# Altium project mRo_CANnode_V1_R1.PrjPcb
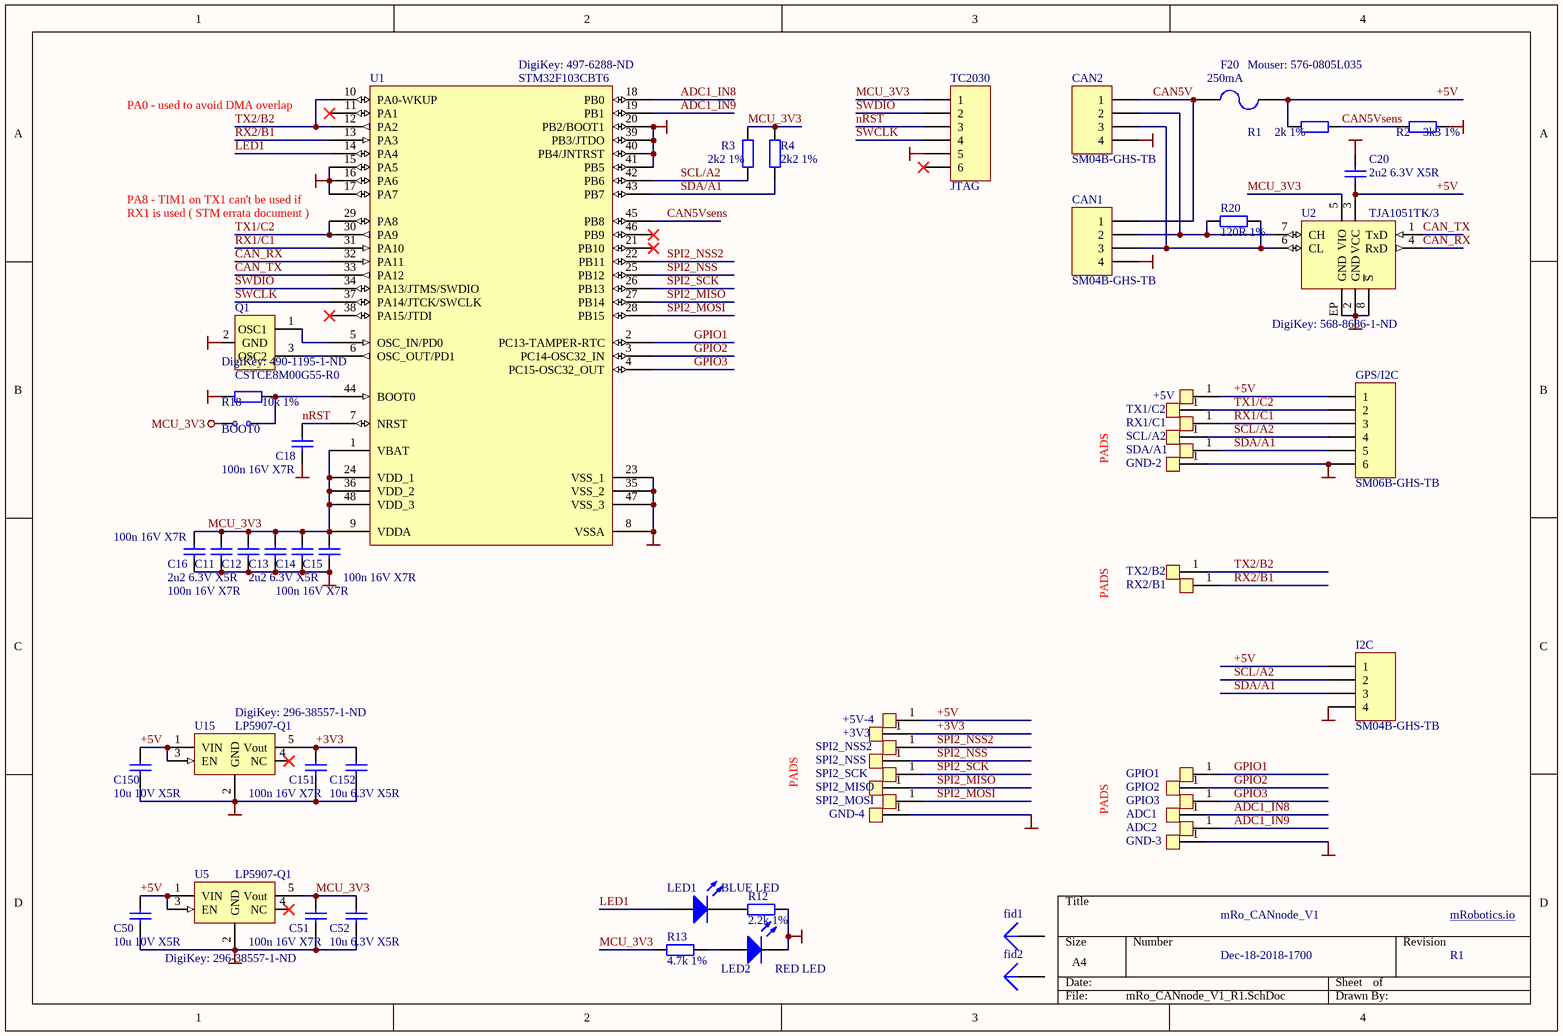
[diagram p0: mRo_CANnode_V1_R1.SchDoc]
1 sheet, 60 parts. Net scope: global (net labels, ports and power ports of the same name join across sheets).
Board file: mRo_CANnode_V1_R1.PcbDoc

## Sheet mRo_CANnode_V1_R1.SchDoc
size A4

### Parts
+3V3  +5V  [SMD_TEST_PAD]  (value not drawn)
+5V  +5V  [SMD_TEST_PAD]  (value not drawn)
+5V-4  +5V  [SMD_TEST_PAD]  (value not drawn)
ADC1  GND  [SMD_TEST_PAD]  (value not drawn)
ADC2  GND  [SMD_TEST_PAD]  (value not drawn)
BOOT0  BLOB  [BLOB 2]  (value not drawn)
C11  100n 16V X7R  [0402A]
C12  2u2 6.3V X5R  [0402A]
C13  2u2 6.3V X5R  [0402A]
C14  100n 16V X7R  [0402A]
C15  100n 16V X7R  [0402A]
C16  100n 16V X7R  [0402A]
C18  100n 16V X7R  [0402A]
C20  2u2 6.3V X5R  [0402A]
C50  10u 10V X5R  [0603A]
C51  100n 16V X7R  [0603A]
C52  10u 6.3V X5R  [0603A]
C150  10u 10V X5R  [0603A]
C151  100n 16V X7R  [0603A]
C152  10u 6.3V X5R  [0603A]
CAN1  SM04B-GHS-TB  [SM04B-GHS-TB]
CAN2  SM04B-GHS-TB  [SM04B-GHS-TB]
F20  250mA  Mouser: 576-0805L035  [0805A]
fid1  (no value)  [SMT_PAD]
fid2  (no value)  [SMT_PAD]
GND-2  GND  [SMD_TEST_PAD]  (value not drawn)
GND-3  GND  [SMD_TEST_PAD]  (value not drawn)
GND-4  GND  [SMD_TEST_PAD]  (value not drawn)
GPIO1  GPIO1  [SMD_TEST_PAD]  (value not drawn)
GPIO2  GPIO2  [SMD_TEST_PAD]  (value not drawn)
GPIO3  GPIO3  [SMD_TEST_PAD]  (value not drawn)
GPS/I2C  SM06B-GHS-TB  [SM06B-GHS-TB]
I2C  SM04B-GHS-TB  [SM04B-GHS-TB]
LED1  BLUE LED  [0603A]
LED2  RED LED  [0603A]
Q1  CSTCE8M00G55-R0  DigiKey: 490-1195-1-ND  [CERALOCK_RES]
R1  2k 1%  [0402A]
R2  3k3 1%  [0402A]
R3  2k2 1%  [0402A]
R4  2k2 1%  [0402A]
R12  2.2k 1%  [0402A]
R13  4.7k 1%  [0603A]
R18  10k 1%  [0402A]
R20  120R 1%  [0603A]
RX1/C1  RX1/TLM/C1  [SMD_TEST_PAD]  (value not drawn)
RX2/B1  RX2/B1  [SMD_TEST_PAD]  (value not drawn)
SCL/A2  SDA  [SMD_TEST_PAD]  (value not drawn)
SDA/A1  SDA/A1  [SMD_TEST_PAD]  (value not drawn)
SPI2_MISO  SPI2_MISO  [SMD_TEST_PAD]  (value not drawn)
SPI2_MOSI  SPI2_MOSI  [SMD_TEST_PAD]  (value not drawn)
SPI2_NSS  SPI2_NSS  [SMD_TEST_PAD]  (value not drawn)
SPI2_NSS2  SPI2_NSS2  [SMD_TEST_PAD]  (value not drawn)
SPI2_SCK  SPI2_SCK  [SMD_TEST_PAD]  (value not drawn)
TC2030  JTAG  [JTAG_TC2030]
TX1/C2  VDD_USB  [SMD_TEST_PAD]  (value not drawn)
TX2/B2  TX2/B2  [SMD_TEST_PAD]  (value not drawn)
U1  STM32F103CBT6  DigiKey: 497-6288-ND  [LQFP48_N]
U2  TJA1051TK/3  DigiKey: 568-8686-1-ND  [8DFN_3x3]
U5  LP5907-Q1  DigiKey: 296-38557-1-ND  [SOT23-5]
U15  LP5907-Q1  DigiKey: 296-38557-1-ND  [SOT23-5]

### Nets
GND: C11.1 C12.1 C13.1 C14.1 C15.1 C16.1 C18.1 C20.1 C50.1 C51.1 C52.1 C150.1 C151.1 C152.1 CAN1.4 CAN2.4 GND-2.1 GND-3.1 GND-4.1 GPS/I2C.6 I2C.4 LED2.2(K) Q1.2(GND) R2.1 R12.1 R18.2 TC2030.5 U1.8(VSSA) U1.15(PA5) U1.16(PA6) U1.17(PA7) U1.20(PB2/BOOT1) U1.23(VSS_1) U1.35(VSS_2) U1.39(PB3/JTDO) U1.40(PB4/JNTRST) U1.41(PB5) U1.47(VSS_3) U2.2(GND) U2.8(~{S}) U2.EP(GND) U5.2(GND) U15.2(GND)
MCU_3V3: BOOT0.1 C11.2 C12.2 C13.2 C14.2 C15.2 C16.2 C51.2 C52.2 R3.1 R4.1 R13.2 TC2030.1 U1.1(VBAT) U1.9(VDDA) U1.24(VDD_1) U1.36(VDD_2) U1.48(VDD_3) U2.5(VIO) U5.5(Vout)
+3V3: +3V3.1 C151.2 C152.2 U15.5(Vout)
+5V: +5V.1 +5V-4.1 C20.2 C50.2 C150.2 F20.2 GPS/I2C.1 I2C.1 R1.2 U2.3(VCC) U5.1(VIN) U5.3(EN) U15.1(VIN) U15.3(EN)
ADC1_IN8: ADC1.1 U1.18(PB0)
ADC1_IN9: ADC2.1 U1.19(PB1)
CAN5V: CAN1.1 CAN2.1 F20.1
CAN5Vsens: R1.1 R2.2 U1.45(PB8)
CAN_RX: U1.32(PA11) U2.4(RxD)
CAN_TX: U1.33(PA12) U2.1(TxD)
GPIO1: GPIO1.1 U1.2(PC13-TAMPER-RTC)
GPIO2: GPIO2.1 U1.3(PC14-OSC32_IN)
GPIO3: GPIO3.1 U1.4(PC15-OSC32_OUT)
LED1: LED1.1(A) U1.14(PA4)
nRST: C18.2 TC2030.3 U1.7(NRST)
RX1/C1: GPS/I2C.3 RX1/C1.1 U1.31(PA10)
RX2/B1: RX2/B1.1 U1.13(PA3)
SCL/A2: GPS/I2C.4 I2C.2 R3.2 SCL/A2.1 U1.42(PB6)
SDA/A1: GPS/I2C.5 I2C.3 R4.2 SDA/A1.1 U1.43(PB7)
SPI2_MISO: SPI2_MISO.1 U1.27(PB14)
SPI2_MOSI: SPI2_MOSI.1 U1.28(PB15)
SPI2_NSS: SPI2_NSS.1 U1.25(PB12)
SPI2_NSS2: SPI2_NSS2.1 U1.22(PB11)
SPI2_SCK: SPI2_SCK.1 U1.26(PB13)
SWCLK: TC2030.4 U1.37(PA14/JTCK/SWCLK)
SWDIO: TC2030.2 U1.34(PA13/JTMS/SWDIO)
TX1/C2: GPS/I2C.2 TX1/C2.1 U1.29(PA8) U1.30(PA9)
TX2/B2: TX2/B2.1 U1.10(PA0-WKUP) U1.12(PA2)
NetBOOT0_2: BOOT0.2 R18.1 U1.44(BOOT0)
NetCAN1_2: CAN1.2 CAN2.2 R20.2 U2.7(CH)
NetCAN1_3: CAN1.3 CAN2.3 R20.1 U2.6(CL)
NetLED1_2: LED1.2(K) R12.2
NetLED2_1: LED2.1(A) R13.1
NetQ1_1: Q1.1(OSC1) U1.5(OSC_IN/PD0)
NetQ1_3: Q1.3(OSC2) U1.6(OSC_OUT/PD1)

Not connected (* = marked no-connect by the designer): fid1 1; fid2 1; TC2030 6*; U1 11(PA1)* 21(PB10)* 38(PA15/JTDI)* 46(PB9)*; U5 4(NC)*; U15 4(NC)*

### Notes on the sheet
- PA0 - used to avoid DMA overlap
- (near U1) PA8 - TIM1 on TX1 can't be used if
- (near U1) RX1 is used ( STM errata document )
- PADS
- mRo_CANnode_V1
- mRobotics.io <http://mRobotics.io>
- Dec-18-2018-1700
- R1

### Library data of the parts
+3V3 +5V +5V-4 ADC1 ADC2 GND-2-GND-4 GPIO1-GPIO3 RX1/C1 RX2/B1 SCL/A2 SDA/A1 SPI2_MISO SPI2_MOSI SPI2_NSS SPI2_NSS2 SPI2_SCK TX1/C2 TX2/B2 = Test pad
C11-C16 C18 C20 C50-C52 C150-C152 = Cap: Capacitor; Value: 100pF; Published: 8-Jun-2000; LatestRevisionDate: 17-Jul-2002; LatestRevisionNote: Re-released for DXP Platform.; PackageReference: RAD-0.3; Publisher: Altium Limited
CAN1 CAN2 I2C = Header 4: Header, 4-Pin; LatestRevisionDate: 17-Jul-2002; LatestRevisionNote: Re-released for DXP Platform.; Publisher: Altium Limited
F20 = Fuse 2: Fuse; Manufacturer: Generic Components; Class: Passive; Published: 08/06/2000; Publisher: Altium Hobart Technology Centre; SubClass: Fuse
fid1 fid2 = Plug: LatestRevisionDate: 17-Jul-2002; LatestRevisionNote: Re-released for DXP Platform.; Publisher: Altium Limited
GPS/I2C TC2030 = Header 6: Header, 6-Pin; LatestRevisionDate: 17-Jul-2002; LatestRevisionNote: Re-released for DXP Platform.; Publisher: Altium Limited
LED1 LED2 = LED0: Typical INFRARED GaAs LED; Published: 8-Jun-2000; LatestRevisionDate: 08-Jul-2005; LatestRevisionNote: Mech Layer 1 removed.; PackageReference: LED-0; Publisher: Altium Limited; PackageDescription: LED; 2 Leads
Q1 = CERAMIC_RESONATOR_3PIN
R1 R2 R12 R13 = Res2: Resistor; Value: 10k; Published: 8-Jun-2000; LatestRevisionDate: 17-Jul-2002; LatestRevisionNote: Re-released for DXP Platform.; PackageReference: AXIAL-0.4; Publisher: Altium Limited; PackageDescription: Axial Device, Thru-Hole; 2 Leads; 0.4 in Pin Spacing
R3 R4 R18 R20 = Res2: Resistor; Value: 1K; Published: 8-Jun-2000; LatestRevisionDate: 17-Jul-2002; LatestRevisionNote: Re-released for DXP Platform.; PackageReference: AXIAL-0.4; Publisher: Altium Limited
  R3 R4: PackageDescription: Axial Device, Thru-Hole; 2 Leads; 0.4 in Pin Spacing
U1 = STM32F103CBT6: STM32 ARM-based 32-bit MCU with 128 Kbytes Flash, 48-pin LQFP, Industrial Temperature; Published: 30-May-2008; DatasheetVersion: rev6, Mar-2008; PackageVersion: Mar-2008; PackageReference: LQFP48; Publisher: Altium Limited; PackageDescription: 48-Pin Low-Profile Quad Flat Pack, 7 x 7 mm Body, 0.5 mm Pitch (LQFP48); ComponentLink1Description: Manufacturer Link; ComponentLink1URL: www.st.com/stm32; ComponentLink2Description: Datasheet; ComponentLink2URL: http://www.st.com/stonline/products/literature/ds/13587.pdf
U2 = TJA1051T